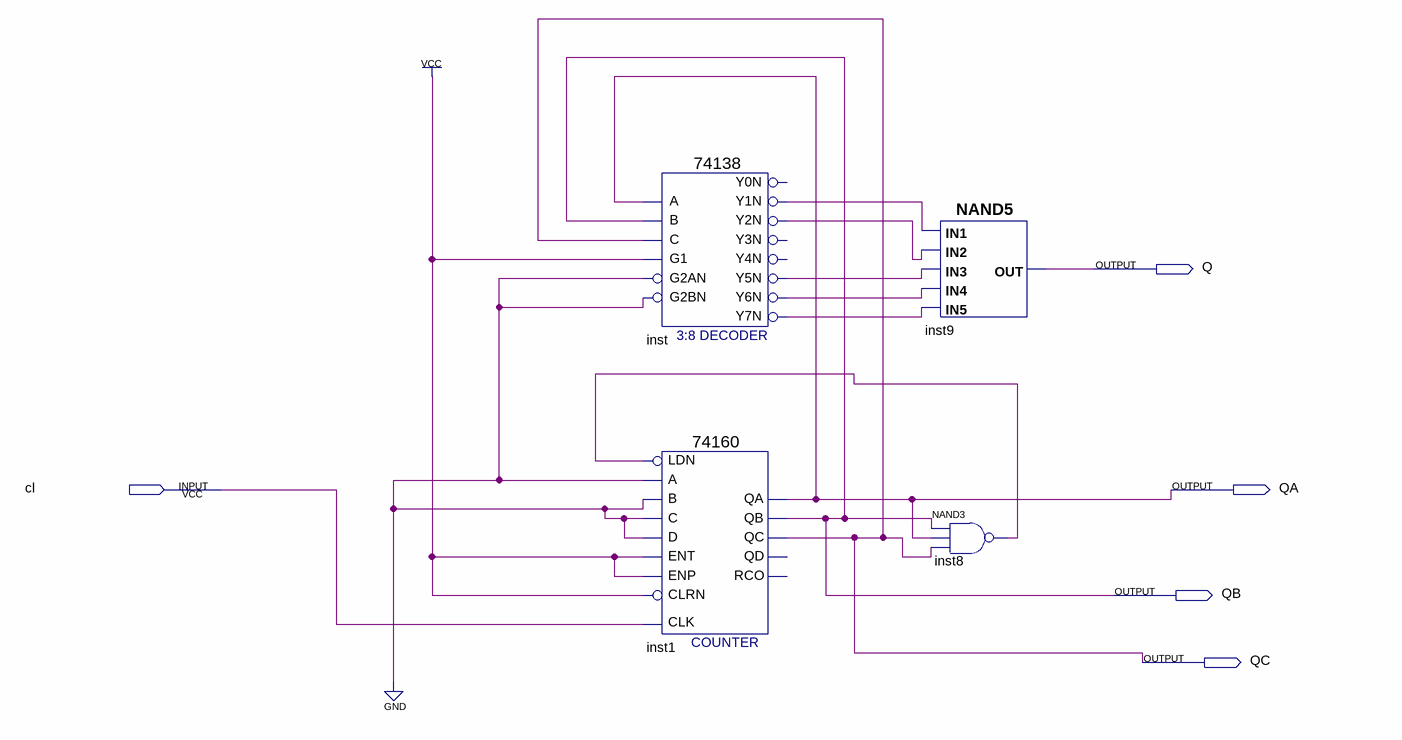
[diagram p0: schematic sheet]
// Quartus schematic ex.bdf as structural Verilog: 4 symbols, 5 pins
module ex (
  input  cl,
  output Q,
  output QA,
  output QB,
  output QC
);

  wire inst8_out, inst_y1n, inst_y2n, inst_y5n, inst_y6n, inst_y7n;

  \74138  inst (
    .A(QA), .B(QB), .G1(1'b1), .C(QC), .G2AN(1'b0), .G2BN(1'b0), .Y1N(inst_y1n), .Y2N(inst_y2n),
    .Y5N(inst_y5n), .Y6N(inst_y6n), .Y7N(inst_y7n));  // open: Y0N, Y3N, Y4N
  \74160  inst1 (
    .CLK(cl), .ENT(1'b1), .A(1'b0), .B(1'b0), .C(1'b0), .D(1'b0), .LDN(inst8_out), .ENP(1'b1), .CLRN(1'b1),
    .QA(QA), .QB(QB), .QC(QC));  // open: QD, RCO
  nand inst9 (Q, inst_y1n, inst_y2n, inst_y5n, inst_y6n, inst_y7n);
  nand inst8 (inst8_out, QB, QA, QC);
endmodule
